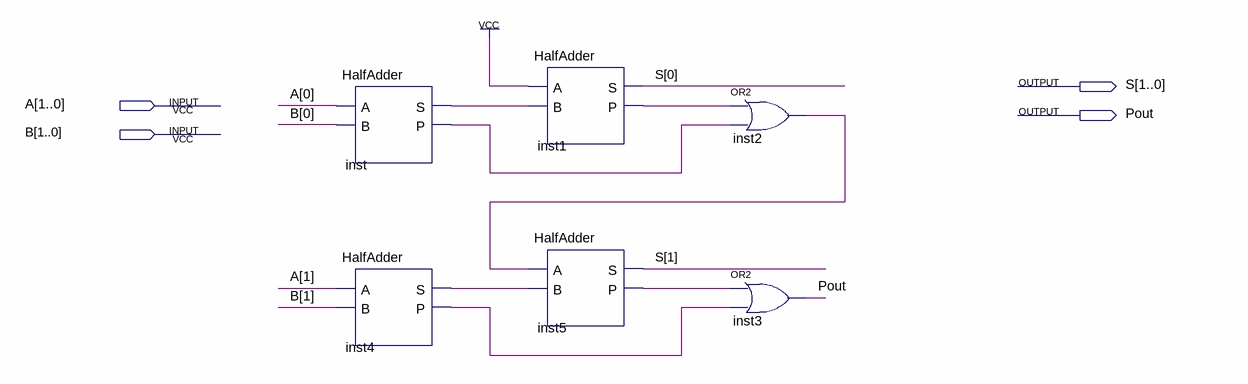
[diagram p0: schematic sheet]
// Quartus schematic Task03.bdf as structural Verilog: 6 symbols, 4 pins
module Task03 (
  input  [1:0] A,
  input  [1:0] B,
  output [1:0] S,
  output Pout
);

  wire inst1_p, inst2_out, inst4_p, inst4_s, inst5_p, inst_p, inst_s;

  HalfAdder inst (.A(A[0]), .B(B[0]), .S(inst_s), .P(inst_p));
  HalfAdder inst4 (.A(A[1]), .B(B[1]), .S(inst4_s), .P(inst4_p));
  HalfAdder inst1 (.A(1'b1), .B(inst_s), .S(S[0]), .P(inst1_p));
  HalfAdder inst5 (.A(inst2_out), .B(inst4_s), .S(S[1]), .P(inst5_p));
  or inst2 (inst2_out, inst1_p, inst_p);
  or inst3 (Pout, inst5_p, inst4_p);
endmodule
